# EAGLE design EncLickDrv_J0104132C-ESPrevB (EAGLE 7.7.0)
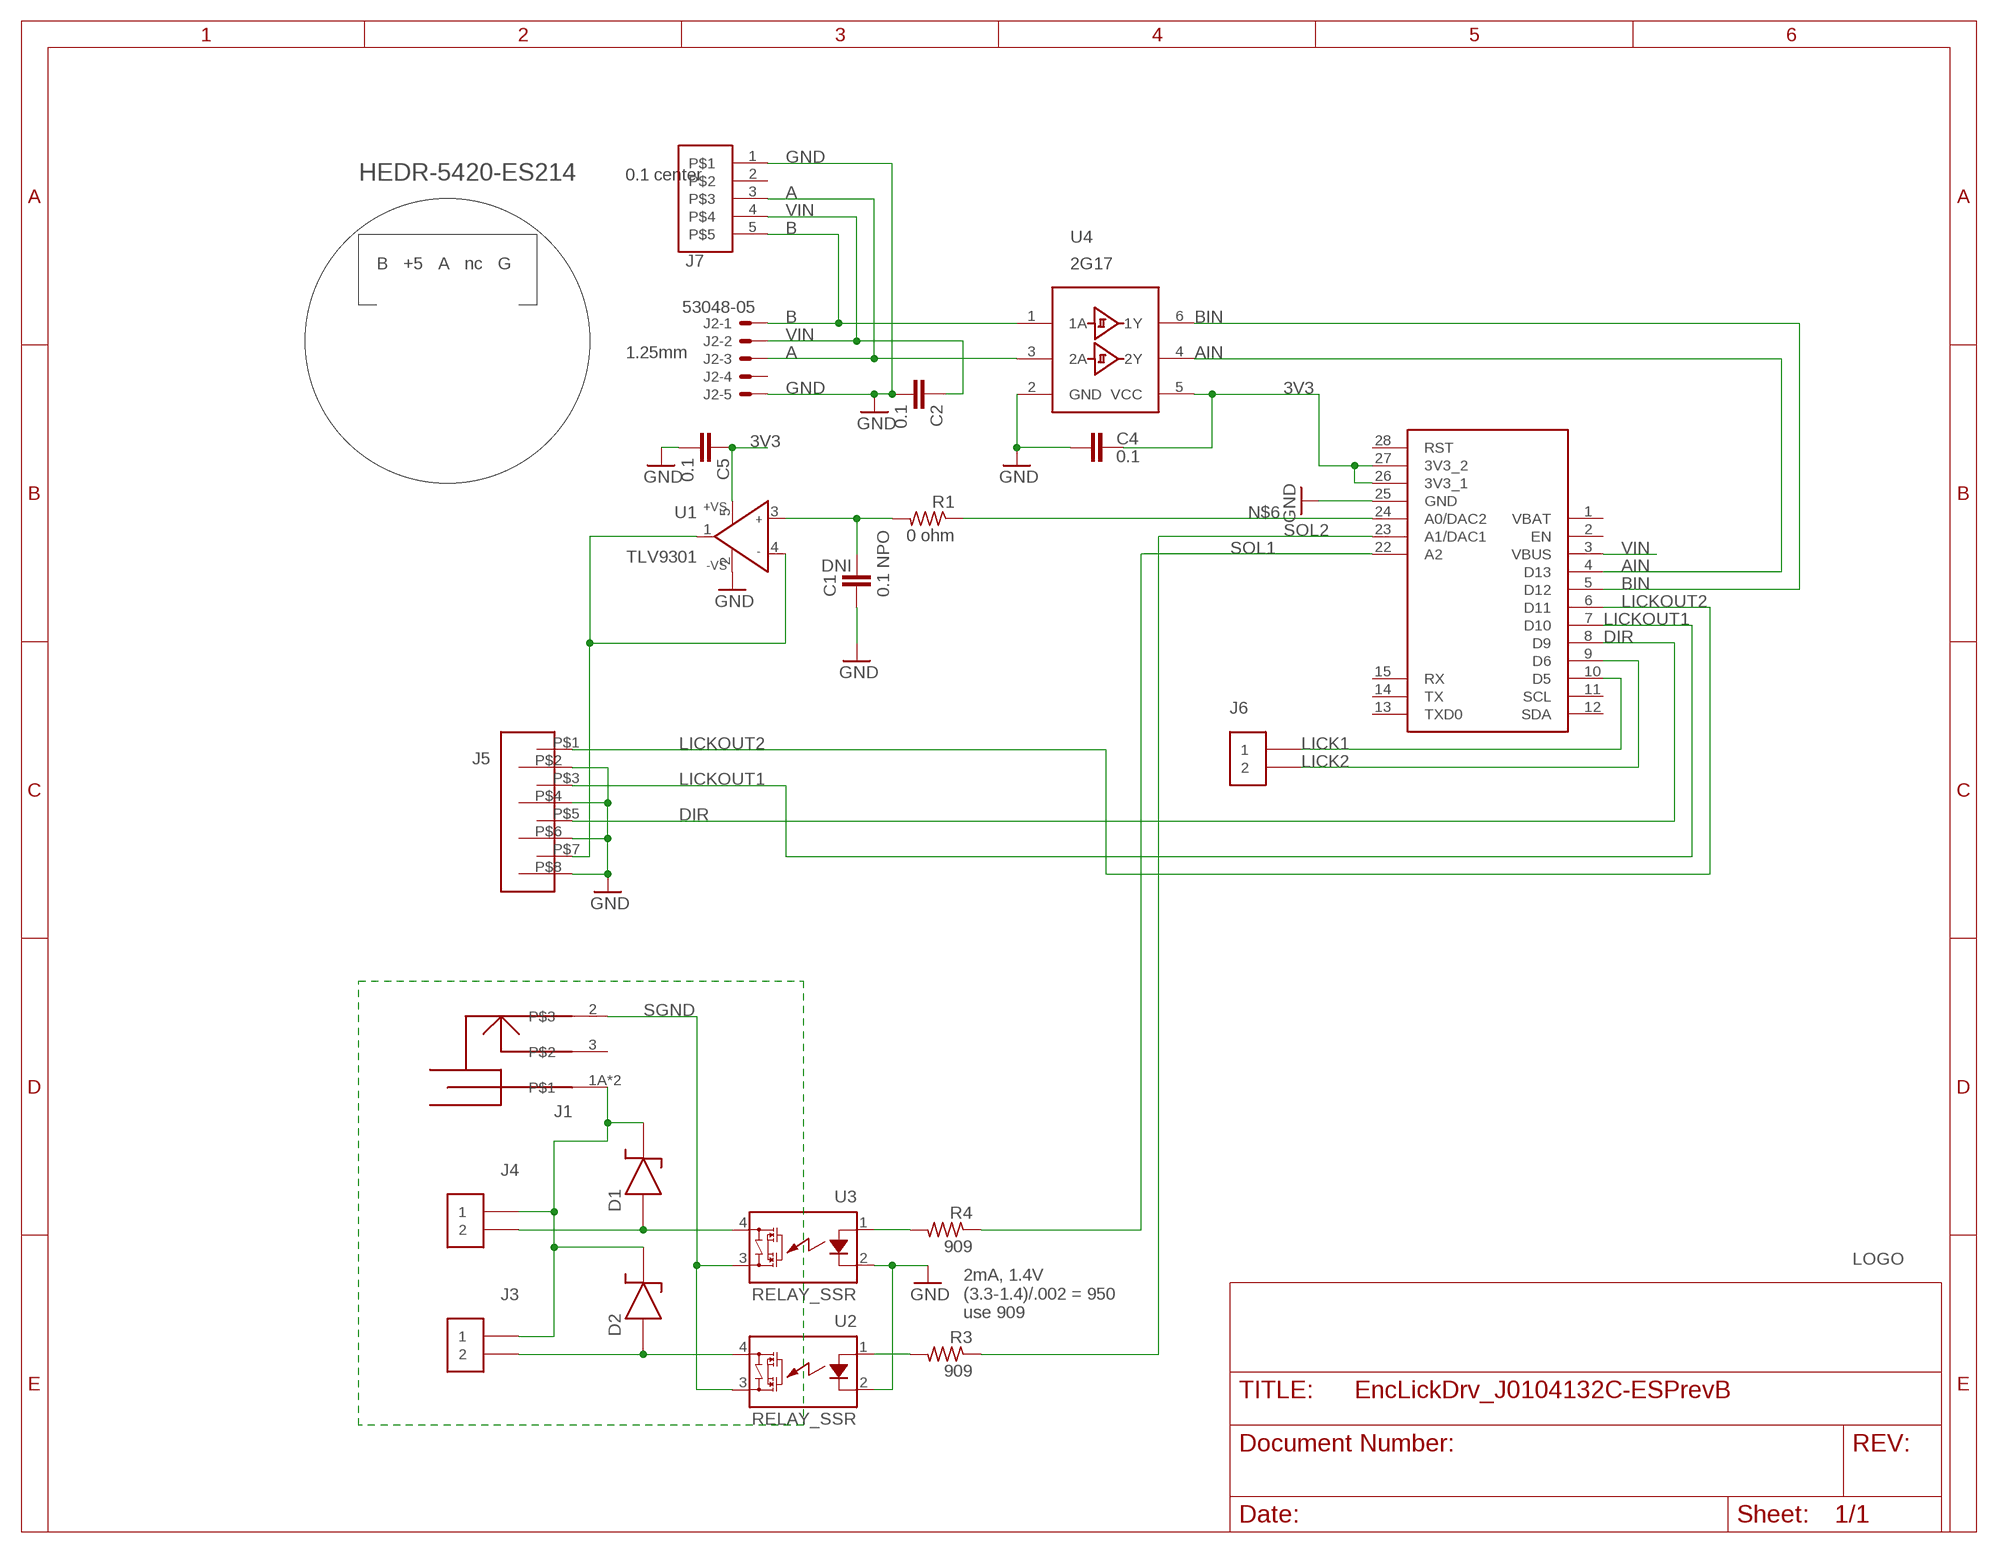
[diagram p0: schematic, sheet 1]

## Parts
C1  0.1 NPO  CAPS1206S  [1206S]
C2  0.1  CAPS0603S  [0603S]
C4  0.1  CAPS0603S  [0603S]
C5  0.1  CAPS0603S  [0603S]
D1  DIODE_SCHOTTKYPWRDI-123  [PWRDI-123]
D2  DIODE_SCHOTTKYPWRDI-123  [PWRDI-123]
J1  POWER_JACK_SHUNTPJ-002  [PJ-002]
J2  53048-05  [53048-05]
J3  CON21881558  [1881558]
J4  CON21881558  [1881558]
J5  CON81844743  [1844743]
J6  CON21881558  [1881558]
J7  CON5104361-4  [104361-4]
M1  ESP32=S2-REV-TFT-NO16-21  [ESP32-S2-REV-TFT-NO16-21]
R1  0 ohm  RESISTOR_SM0805S  [0805S]
R3  909  RESISTOR_SM0805S  [0805S]
R4  909  RESISTOR_SM0805S  [0805S]
U1  TLV9301  AD8065RT  [SOT23-5]
U2  RELAY_SSR  [SSR_SOIP]
U3  RELAY_SSR  [SSR_SOIP]
U4  2G17  [SOT23-6]
U$1  JFRC-LOGOLOGO_OP  [LOGO_BMP_OP]

## Nets
3V3: C4.1 C5.1 M1.26(3V3_1) M1.27(3V3_2) U1.5(+VS) U4.5(VCC)
A: J2.3 J7.3 U4.3(2A)
AIN: M1.4(D13) U4.4(2Y)
B: J2.1 J7.5 U4.1(1A)
BIN: M1.5(D12) U4.6(1Y)
DIR: J5.P$5 M1.8(D9)
GND: C1.2 C2.2 C4.2 C5.2 J2.5 J5.P$2 J5.P$4 J5.P$6 J5.P$8 J7.1 M1.25(GND) U1.2(-VS) U2.2(K) U3.2(K) U4.2(GND)
LICK1: J6.1 M1.10(D5)
LICK2: J6.2 M1.9(D6)
LICKOUT1: J5.P$3 M1.7(D10)
LICKOUT2: J5.P$1 M1.6(D11)
N$1: D1.A J4.2 U3.4(DS1)
N$3: D2.A J3.2 U2.4(DS1)
N$5: D1.K D2.K J1.1A J1.1B J3.1 J4.1
N$6: M1.24(A0/DAC2) R1.1
N$7: R4.2 U3.1(A)
N$8: R3.2 U2.1(A)
N$9: J5.P$7 U1.1(OUT) U1.4(IN-)
N$11: C1.1 R1.2 U1.3(IN+)
SGND: J1.2 U2.3(DS2) U3.3(DS2)
SOL1: M1.22(A2) R4.1
SOL2: M1.23(A1/DAC1) R3.1
VIN: C2.1 J2.2 J7.4 M1.3(VBUS)
Unconnected: J1.3 J2.4 J7.2 M1.1(VBAT) M1.2(EN) M1.11(SCL) M1.12(SDA) M1.13(TXD0) M1.14(TX) M1.15(RX) M1.28(RST)

## Notes on the sheet
- HEDR-5420-ES214 | 0.1 center
- B   +5   A   nc   G
- 1.25mm
- DNI
- 2mA, 1.4V
  (3.3-1.4)/.002 = 950 
  use 909

## Library data of the parts
C1 C2 C4 C5 = STEVES_BU:CAPS
D1 D2 = STEVES_BU:DIODE_SCHOTTKY
J1 = STEVES_BU:POWER_JACK_SHUNT
J2 = con-molex:53?-05: CONNECTOR wire to board 1.25 mm (.049 inch) pitch header; MF: MOLEX; MPN: 53048-0510; OC_FARNELL: 9732926; OC_NEWARK: 57H4722
J3 J4 J6 = STEVES_BU:CON2
J5 = STEVES_BU:CON8
J7 = STEVES_BU:CON5
M1 = Adafruit Feather ESP32-S2 Reverse TFT:ESP32=S2-REV-TFT-NO16-21
R1 R3 R4 = STEVES_BU:RESISTOR_SM
U1 = analog-devices:AD8065: High Performance, 145 MHz FastFET Op Amps Source: http://www.analog.com/static/imported-files/data_sheets/AD8065_8066.pdf; MF: ALTERA CORPORATION; MPN: AD8065ARTZ-REEL7; OC_FARNELL: 1464845; OC_NEWARK: 59K6316
U2 U3 = STEVES_BU:RELAY_SSR
U4 = STEVES_BU:2G17
U$1 = STEVES_BU:JFRC-LOGO

## Board
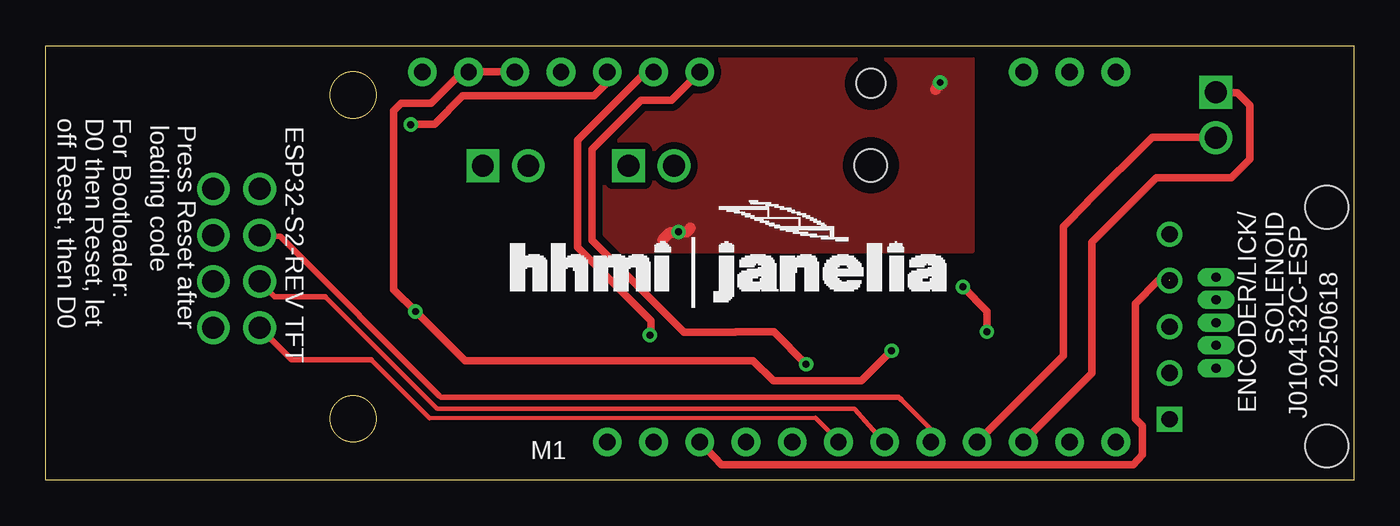
[diagram p1: board, top side]
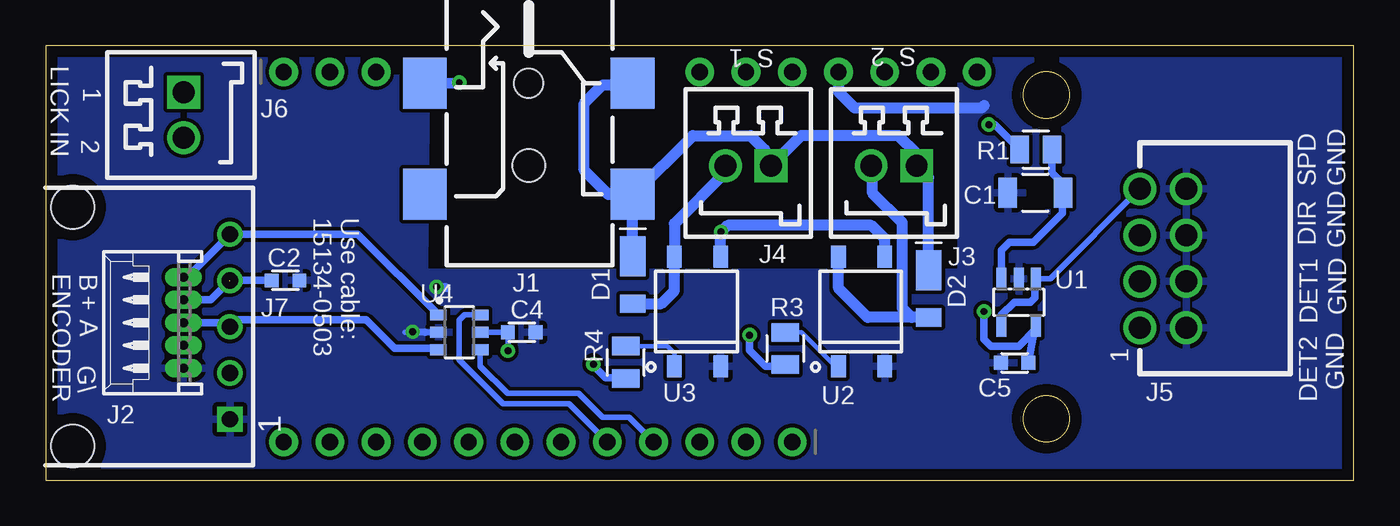
[diagram p2: board, bottom side, seen from below]

Size 71.88 x 23.88 mm. Coordinates in mm from the lower left corner, seen from the top.
Outline: 0,23.88 71.88,23.88 71.88,0 0,0 0,23.88
Outline: circle at 16.89,21.16 radius 1.27
Outline: circle at 16.89,3.38 radius 1.27
Copper layers (1*16): Top 0.035mm / dielectric 1.5mm / Bottom 0.035mm
Design rules "default *": minimum track width 8mil, minimum drill 8mil, track to track 8mil, track to pad 8mil, pad to pad 8mil, via to via 8mil, smd to smd 8mil, copper to edge 25mil, drill to drill 8mil, minimum pad ring 10mil, minimum via ring 8mil, stop-mask expansion 4mil, vias tented up to drill 17mil, thermal gap 10mil

### Footprints (pad centres in the part's own frame; a part is rotated, then mirrored left to right if it is on the bottom)
1206S = smd 1.016 x 1.651: 1 -1.524,0; 2 1.524,0
0603S = smd 0.762 x 0.762: 1 -0.762,0; 2 0.762,0
PWRDI-123 = smd 1 x 1.4: A 1.6,0 | smd 2.2 x 1.4: K -1,0
PJ-002 = smd 2.8 x 2.4: 1A 5,5.7; 1B 11.1,5.7; 2 5,-5.7; 3 11.1,-5.7 | hole 1.6: 5,0 | hole 1.8: 9.5,0
53048-05 = drill 0.5 pad 0.698 long: 1 2.5,-1.25; 2 1.25,-1.25; 3 0,-1.25; 4 -1.25,-1.25; 5 -2.5,-1.25
1881558 = drill 1.2 square: 1 -1.25,0 | drill 1.2: 2 1.25,0
1844743 = drill 1.2: P$1 -3.81,1.27; P$2 -3.81,-1.27; P$3 -1.27,1.27; P$4 -1.27,-1.27; P$5 1.27,1.27; P$6 1.27,-1.27; P$7 3.81,1.27; P$8 3.81,-1.27
104361-4 = drill 0.889 square: 1 -5.08,0 | drill 0.889: 2 -2.54,0; 3 0,0; 4 2.54,0; 5 5.08,0 | hole 2.362: -6.553,8.636; 6.553,8.636
ESP32-S2-REV-TFT-NO16-21 = drill 0.9 pad 1.575: 1 16.51,21.59; 2 19.05,21.59; 3 21.59,21.59; 4 24.13,21.59; 5 26.67,21.59; 6 29.21,21.59; 7 31.75,21.59; 8 34.29,21.59; 9 36.83,21.59; 10 39.37,21.59; 11 41.91,21.59; 12 44.45,21.59; 13 44.45,1.27; 14 41.91,1.27; 15 39.37,1.27; 22 21.59,1.27; 23 19.05,1.27; 24 16.51,1.27; 25 13.97,1.27; 26 11.43,1.27; 27 8.89,1.27; 28 6.35,1.27
0805S = smd 1.016 x 1.524: 1 -0.889,0; 2 0.889,0
SOT23-5 = smd 0.55 x 1.2: 1 -0.95,-1.3; 2 0,-1.3; 3 0.95,-1.3; 4 0.95,1.3; 5 -0.95,1.3
SSR_SOIP = smd 0.8 x 1.2: 1 -1.27,-3; 2 1.27,-3; 3 1.27,3; 4 -1.27,3
SOT23-6 = smd 0.6 x 0.9: 1 -0.95,-1.15; 2 0,-1.15; 3 0.95,-1.15; 4 0.95,1.15; 5 0,1.15; 6 -0.95,1.15

### Placement (x,y rotation side)
C1  17.5,15.8 180 bottom
C2  58.7,10.97 0 bottom
C4  45.72,8.13 0 bottom
C5  18.64,6.45 180 bottom
D1  39.62,11.3 270 bottom
D2  23.37,10.54 270 bottom
J1  45.34,26.8 270 bottom
J2  65.56,8.66 90 bottom
J3  25.27,17.27 180 bottom
J4  33.27,17.27 180 bottom
J5  10.49,12.19 90 bottom
J6  64.29,20.07 270 bottom
J7  61.75,8.43 90 bottom
M1  14.35,23.7 180 bottom
R1  17.48,18.16 0 bottom
R3  31.24,7.24 90 bottom
R4  40.01,6.48 90 bottom
U1  18.41,9.78 180 bottom
U2  27.05,9.27 0 bottom
U3  36.07,9.27 0 bottom
U4  49.15,8.13 270 bottom
U$1  35.69,10.92 0 top

### Tracks (layer width: path | path; a pad name or v marks a point on that pad's centre or on a via)
3V3  (via drill 0.38)
  Top 0.406: M1.26 M1.27 22.91,22.43 21.18,20.7 19.53,20.7 19.13,20.3 19.13,10.46 v20.32,9.27 23.04,6.58 38.86,6.58 39.98,5.46 44.83,5.46 v46.48,7.11
  Bottom 0.305: U4.5 C4.1 v46.48,7.11
  Bottom 0.406: C5.1 17.53,8.42 U1.5 17.46,8.32 18.41,7.37 19.94,7.37 20.32,7.75 v20.32,9.27
A
  Bottom 0.406: U4.3 50.36,7.24 52.7,7.24 54.28,8.81 61.37,8.81 61.54,8.64 | 61.54,8.64 J7.3 | J2.3 61.57,8.66 61.54,8.64
AIN
  Bottom 0.305: U4.4 48,6.27 46.51,4.78 42.6,4.78 42.27,4.45 41.27,3.45 39.83,3.45 M1.4
B
  Bottom 0.406: U4.1 54.73,13.51 J7.5 64.1,11.16 J2.1
BIN
  Bottom 0.305: U4.6 48.86,9.08 49.15,8.79 49.15,6.63 46.74,4.22 43.13,4.22 M1.5
DIR
  Top 0.254: M1.8 48.64,2.79 46.99,4.45
  Top 0.305: J5.P$5 11.81,13.41 12.88,13.41 21.63,4.66 21.73,4.57 46.86,4.57 46.99,4.45
GND  (via drill 0.38)
  Top 0.406: v51.71,8.15 51.71,9.3 v50.39,10.62
  Bottom 0.305: U4.2 51.03,8.13 51.84,8.13 | 52.12,8.13 51.84,8.13 | 51.84,8.13 51.89,8.08
  Bottom 0.406: 51.03,8.13 v51.71,8.15 | v50.39,10.62 49.91,10.62 49.84,10.54
  Bottom 0.61: M1.25 28.32,21.34 27.43,20.45 20.45,20.45 20.32,20.57
  pour Bottom: -5.97,24.51 21.59,24.51 21.59,11.43 51.05,11.43 50.93,25.53 73.28,25.65 73.41,-1.65 -6.22,-1.78
LICK1
  Top 0.406: M1.10 57.48,5.87 57.48,13.08 61.01,16.61 65.15,16.61 66.17,17.63 66.17,20.6 65.48,21.29 64.32,21.29 J6.1
LICK2
  Top 0.406: M1.9 55.91,6.83 55.91,13.92 57.25,15.26 57.25,15.29 60.81,18.85 64.26,18.85 J6.2
LICKOUT1
  Top 0.254: M1.7 46.02,2.11 44.45,3.94 21.51,3.94 15.37,10.08
  Top 0.305: 15.37,10.08 12.6,10.08 J5.P$3
LICKOUT2
  Top 0.254: M1.6 43.56,2.16 42.29,3.43 21.11,3.4 17.88,6.63
  Top 0.305: 17.88,6.63 13.51,6.63 J5.P$1
N$1
  Bottom 0.61: J4.2 34.52,16.91 37.34,14.1 U3.4 37.34,10.41 38.05,9.7 D1.A
N$3
  Bottom 0.61: 24.31,8.94 26.72,8.94 28.32,10.54 U2.4 28.19,12.4 | D2.A 24.31,8.94 | 24.31,8.94 24.82,9.45 24.82,14.15 26.44,15.77 26.44,17.19 J3.2
N$5
  Bottom 0.61: D2.K 23.37,16.62 J3.1 24.02,17.93 25.02,18.92 30.37,18.92 J4.1 32.38,17.63 32.38,18.16 33.15,18.92 36.32,18.92 39.55,15.7 J1.1B | J1.1B 40.97,15.7 42.29,17.02 42.29,20.7 41.27,21.72 39.72,21.72 J1.1A | D1.K 39.62,15.68 J1.1B
N$6  (via drill 0.38)
  Top 0.406: M1.24 30.86,21.84 30.12,21.11 22.91,21.11 21.36,19.56 20.09,19.56 v20.07,19.53
  Bottom 0.406: v20.07,19.53 19.74,19.53 R1.1
N$7
  Bottom 0.254: U3.1 37.34,6.99 37.72,7.37 R4.2
N$8
  Bottom 0.254: U2.1 28.5,6.27 30.35,8.13 R3.2
N$9
  Bottom 0.305: U1.1 16.68,11.08 J5.P$7
  Bottom 0.406: U1.4 19.36,9.08 18.67,9.78 17.78,9.78 17.53,10.03 17.53,11.02 U1.1
N$11
  Bottom 0.406: U1.3 19.36,12.64 18.92,13.08 17.6,13.08 16.03,14.66 16.03,15.75 C1.1 15.98,16.28 16.59,16.89 R1.2
SGND  (via drill 0.38)
  Top 0.61: 34.92,13.59 34.29,13.59 33.91,13.21 | v49.15,21.84 49.15,21.72 48.9,21.46 | v34.77,13.64 35.23,13.64 35.43,13.84
  Bottom 0.61: J1.2 v49.15,21.84 | U2.3 25.78,13.26 26.52,13.99 34.42,13.99 v34.77,13.64 34.82,13.59 34.82,12.3 U3.3
  pour Top (isolate 0.381): 25.02,24.51 50.93,24.38 50.93,12.57 25.02,12.57
SOL1  (via drill 0.38)
  Top 0.406: v41.78,6.38 40.01,8.15 37.92,8.15 37.9,8.13 35.08,8.13 30.02,13.18 30.02,18.19 32.72,20.88 34.39,20.88 M1.22
  Bottom 0.406: v41.78,6.38 41.78,6.3 41.12,5.64 40.06,5.64 R4.1
SOL2  (via drill 0.38)
  Top 0.406: M1.23 32.99,22.43 29.23,18.67 29.23,12.8 33.27,8.76 33.27,8.05 v33.2,7.98
  Bottom 0.406: v33.2,7.98 33.2,7.14 32.33,6.27 31.32,6.27 R3.1
VIN  (1 unrouted)
  Top 0.406: 61.77,10.95 61.11,10.95 59.87,9.7 59.87,3.38 60.25,3 60.25,1.4 59.77,0.86 37.13,0.86 M1.3
  Bottom 0.406: C2.1 J7.4 62.81,9.91 J2.2

### Text on the board
tPlace: For Bootloader: / D0 then Reset, let / off Reset, then D0 | Press Reset after / loading code | ESP32-S2-REV TFT | ENCODER/LICK/ / SOLENOID | 20250618 | J0104132C-ESP
bPlace: S 2 | S 1 | LICK IN | 1 | 2 | GND | SPD | Use cable: / 15134-0503 | GND | DIR | B | ENCODER | + | GND | DET1 | A | G\ | GND | DET2